# Altium schematic sheet TControlWindow.schDOC
size B; Organization: Altium Limited; Address1: L3, 12a Rodborough Rd; Address2: Frenchs Forest; Address3: NSW; Address4: Australia 2086; DocumentNumber: 1; SheetNumber: 1; SheetTotal: 4
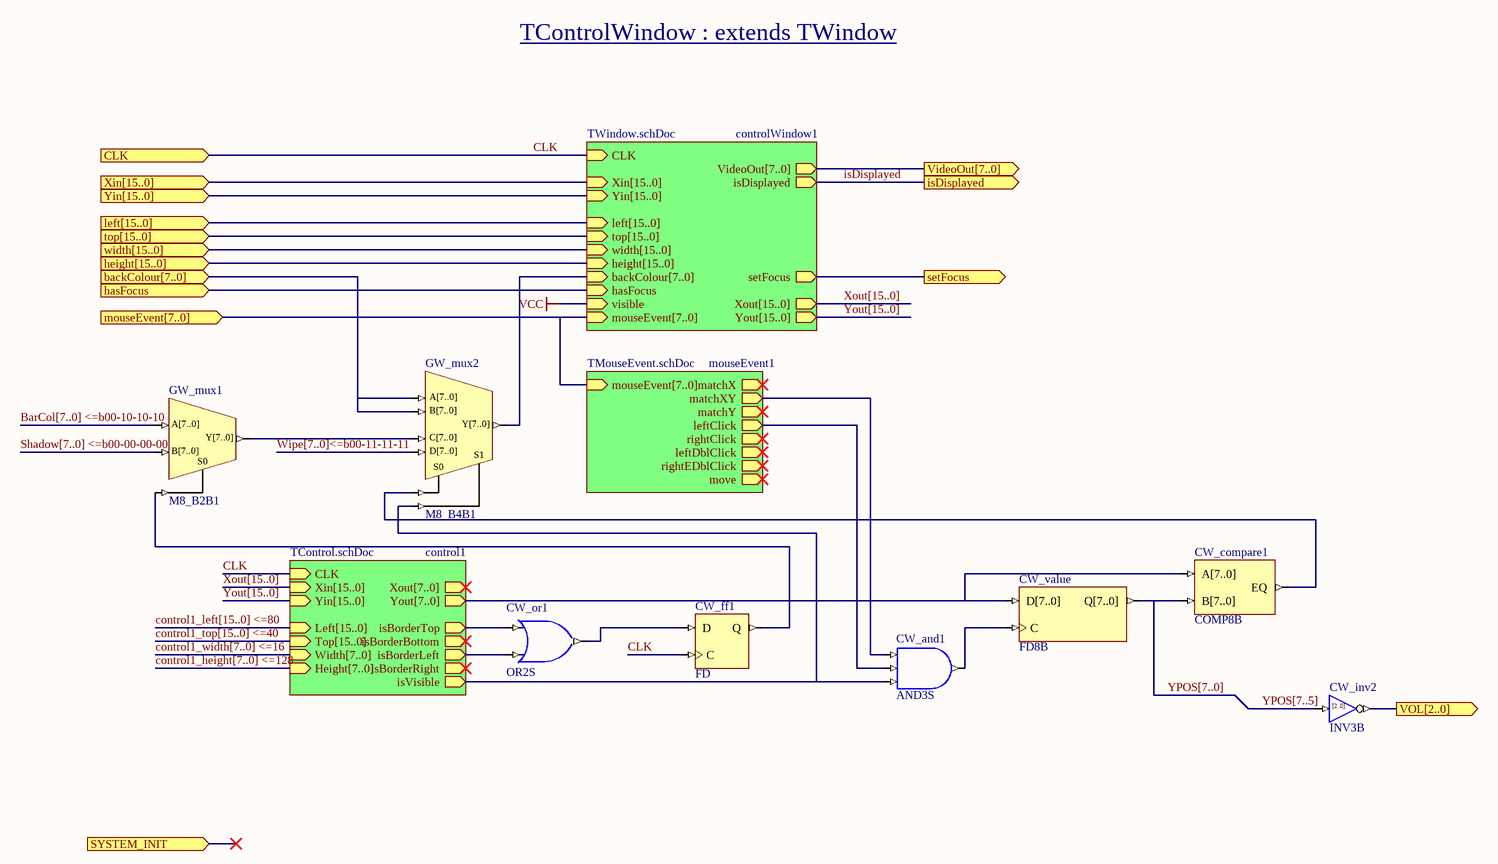
[diagram p0: TControlWindow.schDOC]

## Parts
CW_and1  AND3S
CW_compare1  COMP8B
CW_ff1  FD
CW_inv2  INV3B
CW_or1  OR2S
CW_value  FD8B
GW_mux1  M8_B2B1
GW_mux2  M8_B4B1

## Sub-sheets
control1 = TControl.schDoc: Xin[15..0] (in), Left[15..0] (in), Width[7..0] (in), CLK (in), Yin[15..0] (in), Top[15..0] (in), Height[7..0] (in), isVisible (out), Xout[7..0] (out), Yout[7..0] (out), isBorderRight (out), isBorderLeft (out), isBorderBottom (out), isBorderTop (out)
controlWindow1 = TWindow.schDoc: CLK (in), VideoOut[7..0] (out), Xin[15..0] (in), Yin[15..0] (in), top[15..0] (in), width[15..0] (in), height[15..0] (in), left[15..0] (in), Xout[15..0] (out), Yout[15..0] (out), backColour[7..0] (in), isDisplayed (out), visible (in), hasFocus (in), setFocus (out), mouseEvent[7..0] (in)
mouseEvent1 = TMouseEvent.schDoc: mouseEvent[7..0] (in), matchX (out), matchXY (out), matchY (out), leftClick (out), rightClick (out), leftDblClick (out), rightEDblClick (out), move (out)

## Ports
backColour[7..0] (in), CLK (in), hasFocus (in), height[15..0] (in), isDisplayed (out), left[15..0] (in), mouseEvent[7..0] (in), setFocus (out), SYSTEM_INIT (in), top[15..0] (in), VideoOut[7..0] (out), VOL[2..0] (out), width[15..0] (in), Xin[15..0] (in), Yin[15..0] (in)

## Nets
VCC: sheet controlWindow1/visible
backColour[7..0]: GW_mux2.A[7..0] GW_mux2.B[7..0] ; port backColour[7..0]
BarCol[7..0] <=b00-10-10-10: GW_mux1.A[7..0]
CLK: CW_ff1.C ; port CLK, sheet controlWindow1/CLK, sheet control1/CLK
hasFocus: port hasFocus, sheet controlWindow1/hasFocus
isDisplayed: port isDisplayed, sheet controlWindow1/isDisplayed
setFocus: port setFocus, sheet controlWindow1/setFocus
Shadow[7..0] <=b00-00-00-00: GW_mux1.B[7..0]
VOL[2..0]: CW_inv2.O[2..0] ; port VOL[2..0]
Wipe[7..0]<=b00-11-11-11: GW_mux2.D[7..0]
YPOS[7..0]: CW_compare1.B[7..0] CW_value.Q[7..0]
YPOS[7..5]: CW_inv2.I[2..0]
NetCW_and1_I0: CW_and1.I0 ; sheet mouseEvent1/matchXY
NetCW_and1_I1: CW_and1.I1 ; sheet mouseEvent1/leftClick
NetCW_and1_I2: CW_and1.I2 GW_mux2.S1 ; sheet control1/isVisible
NetCW_and1_O: CW_and1.O CW_value.C
NetCW_compare1_A[7..0]: CW_compare1.A[7..0] CW_value.D[7..0] ; sheet control1/Yout[7..0]
NetCW_compare1_EQ: CW_compare1.EQ GW_mux2.S0
NetCW_ff1_D: CW_ff1.D CW_or1.O
NetCW_ff1_Q: CW_ff1.Q GW_mux1.S0
NetCW_or1_I0: CW_or1.I0 ; sheet control1/isBorderTop
NetCW_or1_I1: CW_or1.I1 ; sheet control1/isBorderLeft
NetGW_mux1_Y[7..0]: GW_mux1.Y[7..0] GW_mux2.C[7..0]
NetGW_mux2_Y[7..0]: GW_mux2.Y[7..0] ; sheet controlWindow1/backColour[7..0]

## Buses and harness runs
bus BarCol[7..0] <=b00-10-10-10
bus control1_height[7..0] <=128 = sheet control1/Height[7..0]
bus control1_left[15..0] <=80 = sheet control1/Left[15..0]
bus control1_top[15..0] <=40 = sheet control1/Top[15..0]
bus control1_width[7..0] <=16 = sheet control1/Width[7..0]
bus port height[15..0] = sheet controlWindow1/height[15..0]
bus port left[15..0] = sheet controlWindow1/left[15..0]
bus port mouseEvent[7..0] = sheet controlWindow1/mouseEvent[7..0] = sheet mouseEvent1/mouseEvent[7..0]
bus port top[15..0] = sheet controlWindow1/top[15..0]
bus port VideoOut[7..0] = sheet controlWindow1/VideoOut[7..0]
bus port width[15..0] = sheet controlWindow1/width[15..0]
bus port Xin[15..0] = sheet controlWindow1/Xin[15..0]
bus port Yin[15..0] = sheet controlWindow1/Yin[15..0]
bus Shadow[7..0] <=b00-00-00-00
bus Wipe[7..0]<=b00-11-11-11
bus Xout[15..0] = sheet control1/Xin[15..0]
bus Xout[15..0] = sheet controlWindow1/Xout[15..0]
bus Yout[15..0] = sheet control1/Yin[15..0]
bus Yout[15..0] = sheet controlWindow1/Yout[15..0]
bus YPOS[7..0]
bus YPOS[7..5]

## Notes on the sheet
- TControlWindow : extends TWindow
- Title
- Size:
- Date:
- B
- Number:
- Time:
- Revision:
- Sheet
- of
- File:
- (in symbol INV3B) [2..0]

## Library data of the parts
CW_and1 = AND3S: 3-Input AND Gate, Single Pin Version; Xilinx Equivalent: AND3; ArchiveName: GENERIC; VHDLIB_SIM: GENERIC_LIB; Published: 28-Jan-2004; Publisher: Altium Limited; Core Revision: 1.00.00
CW_compare1 = COMP8B: 8-Bit Identity Comparator, Bus Version; Xilinx Equivalent: COMP8; ArchiveName: GENERIC; VHDLIB_SIM: GENERIC_LIB; Published: 28-Jan-2004; Publisher: Altium Limited; Core Revision: 1.00.00
CW_ff1 = FD: D-Type Flip-Flop; ArchiveName: GENERIC; VHDLIB_SIM: GENERIC_LIB; Published: 28-Jan-2004; Publisher: Altium Limited; Xilinx Equivalent: FD; Core Revision: 1.00.00
CW_inv2 = INV3B: 3-Bit Inverter, Bus Version; ArchiveName: GENERIC; VHDLIB_SIM: GENERIC_LIB; Published: 28-Jan-2004; Publisher: Altium Limited; Core Revision: 1.00.00
CW_or1 = OR2S: 2-Input OR Gate, Single Pin Version; Xilinx Equivalent: OR2; ArchiveName: GENERIC; VHDLIB_SIM: GENERIC_LIB; Published: 28-Jan-2004; Publisher: Altium Limited; Core Revision: 1.00.00
CW_value = FD8B: 8-Bit D-Type Flip-Flop, Bus Version; Xilinx Equivalent: FD8; ArchiveName: GENERIC; VHDLIB_SIM: GENERIC_LIB; Published: 28-Jan-2004; Publisher: Altium Limited; Core Revision: 1.00.00
GW_mux1 = M8_B2B1: 2x8-Bit Bus to 1x8-Bit Bus Multiplexer; ArchiveName: GENERIC; VHDLIB_SIM: GENERIC_LIB; Published: 28-Jan-2004; Publisher: Altium Limited; Core Revision: 1.00.00
GW_mux2 = M8_B4B1: 4x8-Bit Bus to 1x8-Bit Bus Multiplexer; ArchiveName: GENERIC; VHDLIB_SIM: GENERIC_LIB; Published: 28-Jan-2004; Publisher: Altium Limited; Core Revision: 1.00.00